# Altium project CANPLC_IO_v1.PrjPcb
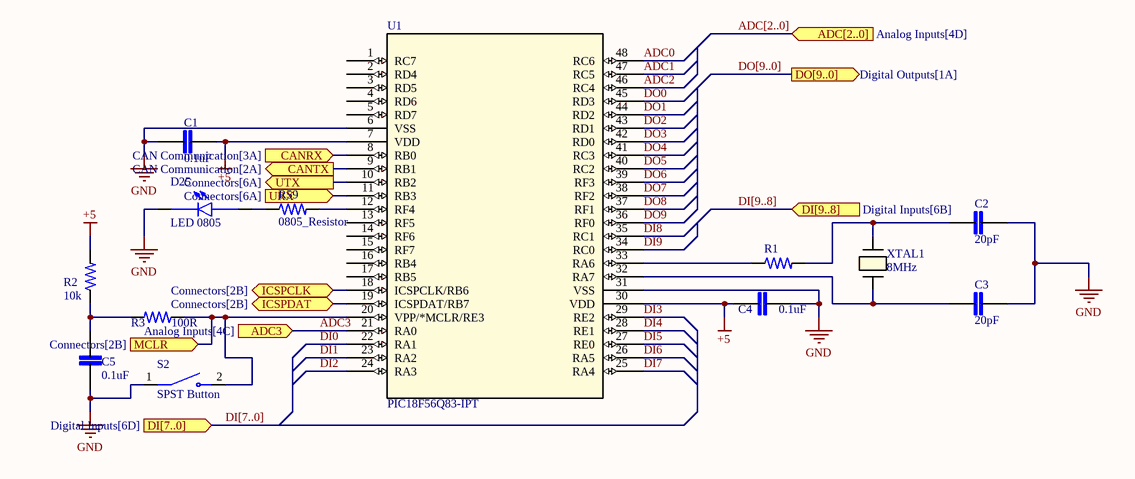
[diagram p0: PIC18F56Q83.SchDoc]
7 sheets, 136 parts. Net scope: flat (ports and power ports of the same name join across sheets).
Board files: TestPCB.PcbDoc, CANPLC_IO.PcbDoc
Sheets:
  PIC18F56Q83.SchDoc
  Digital Inputs.SchDoc
  Digital Outputs.SchDoc
  Analog Inputs.SchDoc
  CAN Communication.SchDoc
  Connectors.SchDoc
  Power.SchDoc

## Sheet PIC18F56Q83.SchDoc
size A4; SheetNumber: 1; SheetTotal: 7

### Parts
C1  0.1uF  [0805]
C2  20pF  [0805]
C3  20pF  [0805]
C4  0.1uF  [0805]
C5  0.1uF  [0805]
D25  LED 0805  [LED 0805]
R1  0805_Resistor  [0805]  (value not drawn)
R2  10k  [0805]
R3  100R  [0805]
R59  0805_Resistor  [0805]
S2  SPST Button  [SPST Button]
U1  PIC18F56Q83-IPT  [PIC18F56Q83-IPT]
XTAL1  8MHz  [Crystal 8MHz]

### Ports
ADC3 (in, see Analog Inputs[4C]), ADC[2..0] (in, see Analog Inputs[4D]), CANRX (in, see CAN Communication[3A]), CANTX (out, see CAN Communication[2A]), DI[7..0] (in, see Digital Inputs[6D]), DI[9..8] (in, see Digital Inputs[6B]), DO[9..0] (out, see Digital Outputs[1A]), ICSPCLK (bidir, see Connectors[2B]), ICSPDAT (bidir, see Connectors[2B]), MCLR (in, see Connectors[2B]), URX (in, see Connectors[6A]), UTX (out, see Connectors[6A])

### Nets
+5: C1.1 C4.1 R2.2 U1.7(VDD) U1.30(VDD)
GND: C1.2 C2.2 C3.2 C4.2 C5.1 D25.C S2.1 U1.6(VSS) U1.31(VSS)
ADC0: U1.48(RC6)
ADC1: U1.47(RC5)
ADC2: U1.46(RC4)
ADC3: U1.21(RA0) ; port ADC3
DI0: U1.22(RA1)
DI1: U1.23(RA2)
DI2: U1.24(RA3)
DI3: U1.29(RE2)
DI4: U1.28(RE1)
DI5: U1.27(RE0)
DI6: U1.26(RA5)
DI7: U1.25(RA4)
DI8: U1.35(RC1)
DI9: U1.34(RC0)
DO0: U1.45(RD3)
DO1: U1.44(RD2)
DO2: U1.43(RD1)
DO3: U1.42(RD0)
DO4: U1.41(RC3)
DO5: U1.40(RC2)
DO6: U1.39(RF3)
DO7: U1.38(RF2)
DO8: U1.37(RF1)
DO9: U1.36(RF0)
NetC2_1: C2.1 R1.2 XTAL1.2
NetC3_1: C3.1 U1.32(RA7) XTAL1.1
NetC5_2: C5.2 R2.1 R3.2
NetD25_A: D25.A R59.1
NetJ3_01: R3.1 S2.2 U1.20(VPP/*MCLR/RE3) ; port MCLR
NetJ3_04: U1.19(ICSPDAT/RB7) ; port ICSPDAT
NetJ3_05: U1.18(ICSPCLK/RB6) ; port ICSPCLK
NetJ4_3: U1.11(RB3) ; port URX
NetR1_1: R1.1 U1.33(RA6)
NetR57_1: U1.10(RB2) ; port UTX
NetR59_2: R59.2 U1.12(RF4)
NetU1_8: U1.8(RB0) ; port CANRX
NetU1_9: U1.9(RB1) ; port CANTX

Not connected (* = marked no-connect by the designer): U1 1(RC7) 2(RD4) 3(RD5) 4(RD6) 5(RD7) 13(RF5) 14(RF6) 15(RF7) 16(RB4) 17(RB5)

### Buses and harness runs
bus ADC[2..0] = port ADC[2..0]
bus DI[7..0] = port DI[7..0]
bus DI[9..8] = port DI[9..8]
bus DO[9..0] = port DO[9..0]

### Library data of the parts
C1-C5 = 0805_Capacitor: MP: LD051A121KAB2A; MF: AVX; SnapEDA_Link: https://www.snapeda.com/parts/LD051A121KAB2A/AVX/view-part/?ref=snap; Package: 0805 AVX; Check_prices: https://www.snapeda.com/parts/LD051A121KAB2A/AVX/view-part/?ref=eda; Purchase-URL: https://pricing.snapeda.com/search/part/LD051A121KAB2A/?ref=eda; Price: None; Value: *; Availability: In Stock
D25 = LED 0805: LED Uni-Color Green 4-Pin Chip 0805 T/R; MP: 597-3305-607F; Availability: Unavailable; Value: *; Price: None; Package: None
R1-R3 R59 = 0805_Resistor: Power_Rating: .25 W; MP: 2-2176053-0; Tolerance: 1%; Resistance: .33; MF: TE Connectivity; Price: None; Availability: In Stock; EU_RoHS_Compliance: Compliant with Exemptions; Package: 0805; Value: *; SnapEDA_Link: https://www.snapeda.com/parts/2-2176053-0/TE+Connectivity/view-part/?ref=snap; Check_prices: https://www.snapeda.com/parts/2-2176053-0/TE+Connectivity/view-part/?ref=eda
S2 = SPST Button: 3mmX6mm; MP: B3U-1000P; Price: None; Availability: Unavailable; Value: *; Package: None
U1 = PIC18F56Q83-IPT: No Description Available; Mfr_Name: Microchip; RefDes: RefDes; Type: Type
XTAL1 = Crystal 8MHz: 5032; Mfr_Name: Epson; Manufacturer_Part_Number: SC32A-12.5PF20PPM; Copyright: Copyright (C) 2024 Ultra Librarian. All rights reserved.; RefDes: RefDes; Type: DEV

## Sheet Digital Inputs.SchDoc
size A3; SheetNumber: 2; SheetTotal: 7
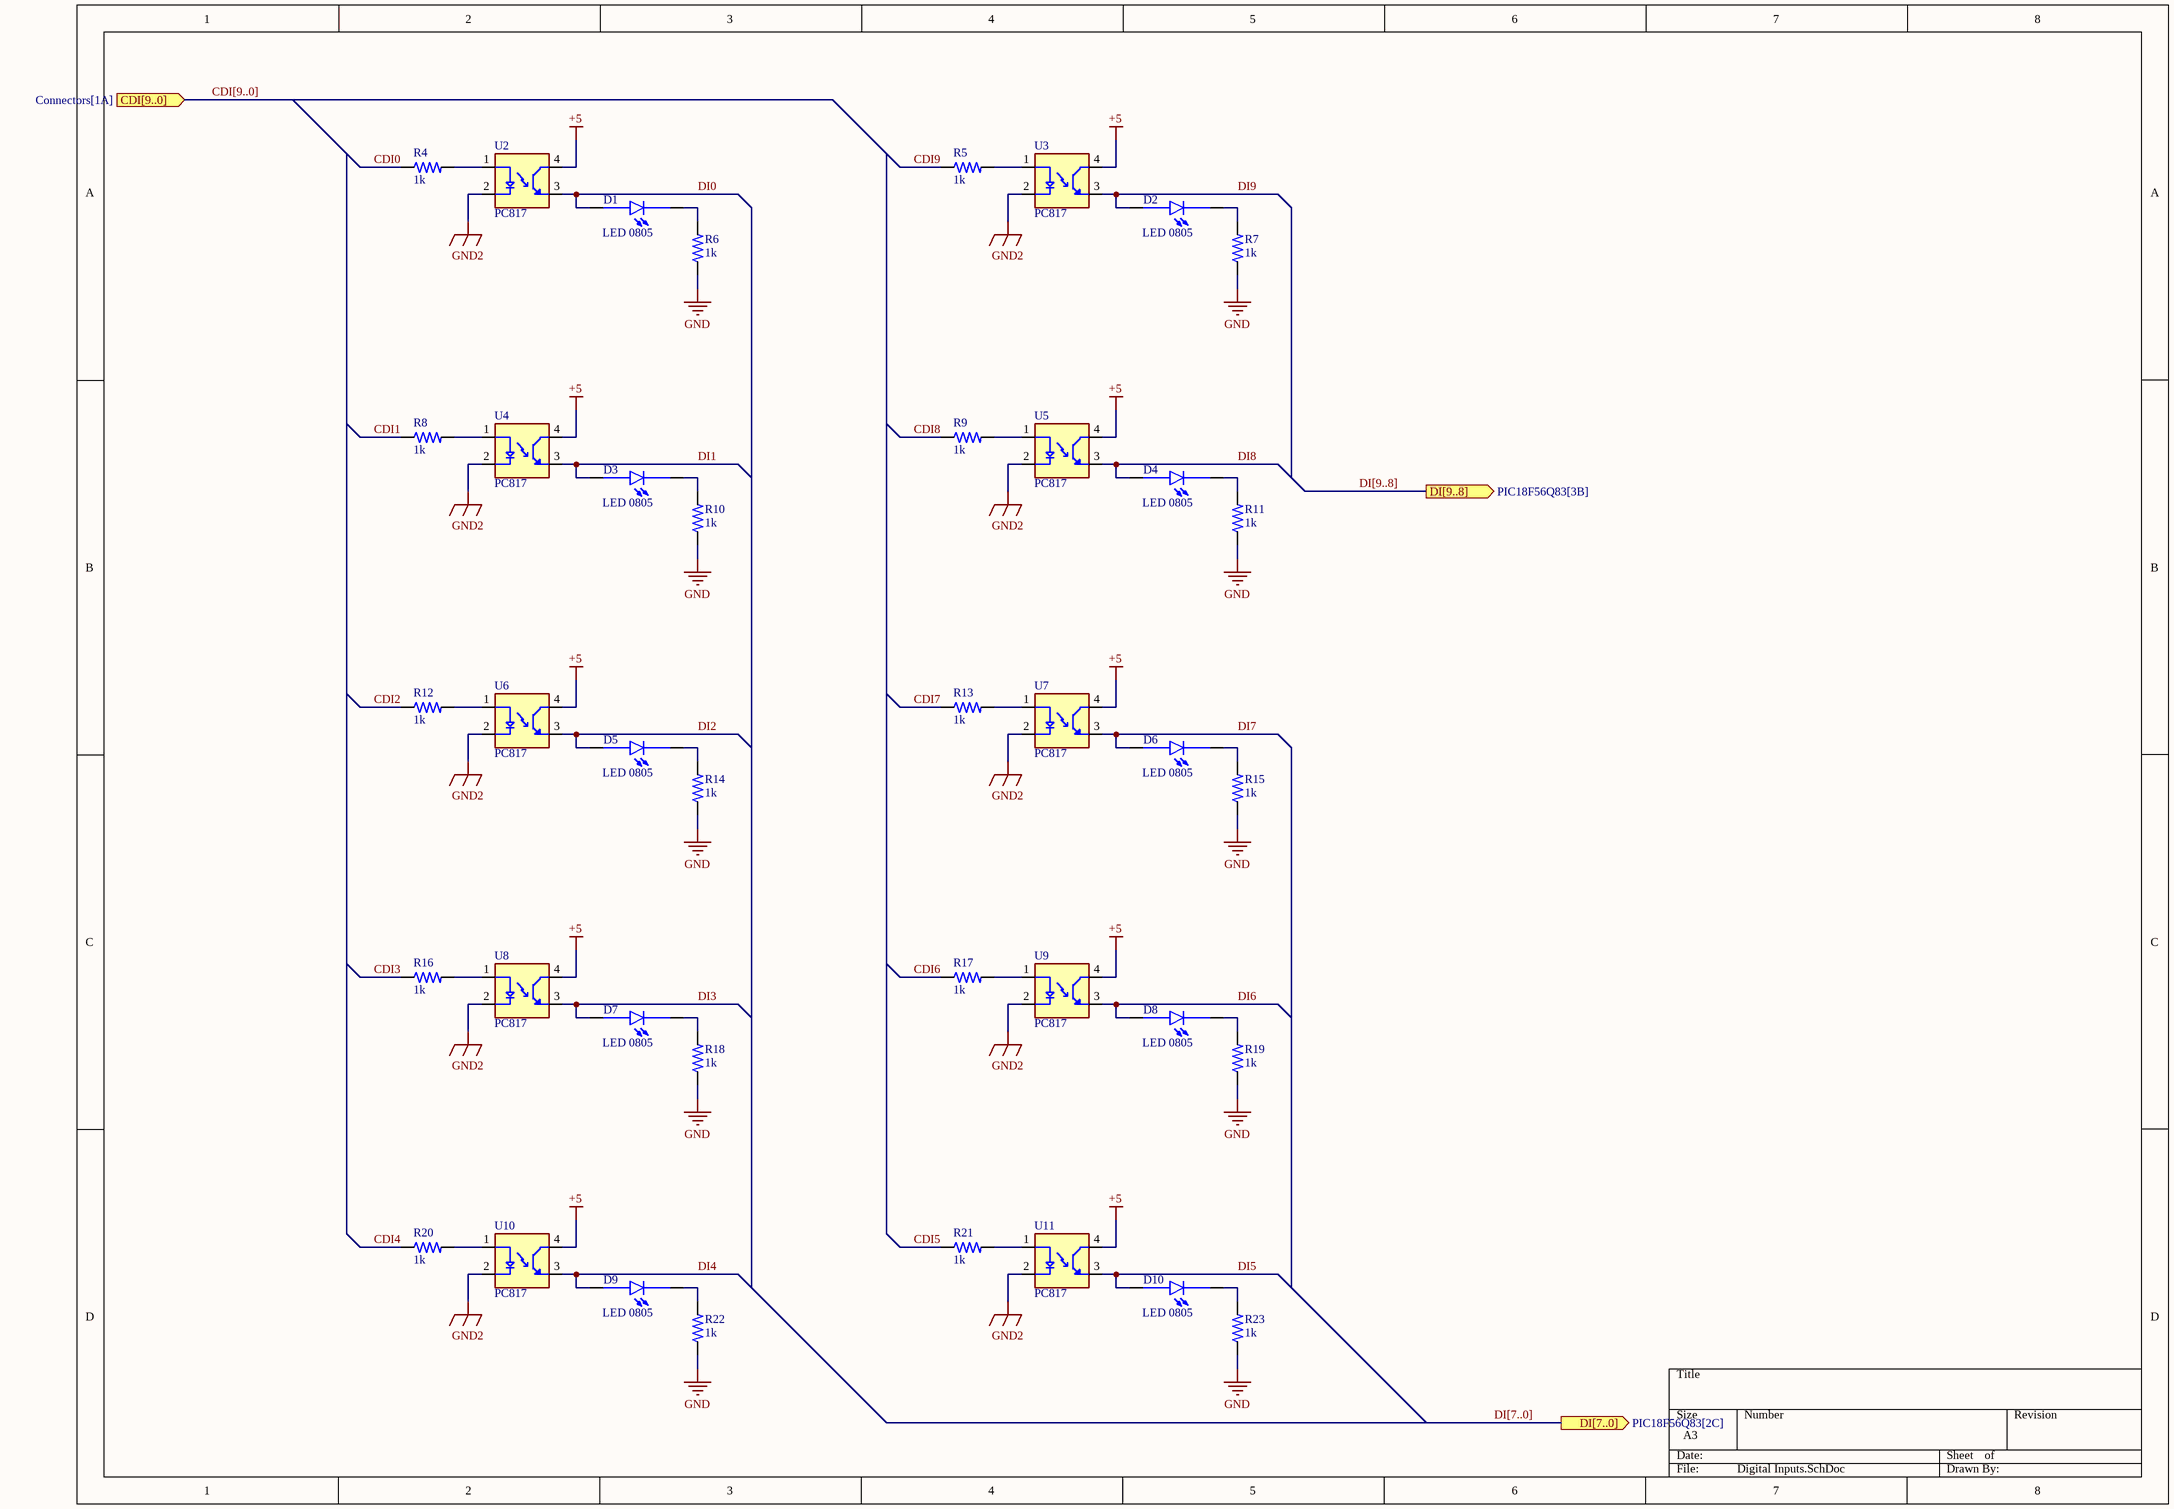
[diagram p1: Digital Inputs.SchDoc]

### Parts
D1  LED 0805  [LED 0805]
D2  LED 0805  [LED 0805]
D3  LED 0805  [LED 0805]
D4  LED 0805  [LED 0805]
D5  LED 0805  [LED 0805]
D6  LED 0805  [LED 0805]
D7  LED 0805  [LED 0805]
D8  LED 0805  [LED 0805]
D9  LED 0805  [LED 0805]
D10  LED 0805  [LED 0805]
R4  1k  [0805]
R5  1k  [0805]
R6  1k  [0805]
R7  1k  [0805]
R8  1k  [0805]
R9  1k  [0805]
R10  1k  [0805]
R11  1k  [0805]
R12  1k  [0805]
R13  1k  [0805]
R14  1k  [0805]
R15  1k  [0805]
R16  1k  [0805]
R17  1k  [0805]
R18  1k  [0805]
R19  1k  [0805]
R20  1k  [0805]
R21  1k  [0805]
R22  1k  [0805]
R23  1k  [0805]
U2  PC817  [PC817]
U3  PC817  [PC817]
U4  PC817  [PC817]
U5  PC817  [PC817]
U6  PC817  [PC817]
U7  PC817  [PC817]
U8  PC817  [PC817]
U9  PC817  [PC817]
U10  PC817  [PC817]
U11  PC817  [PC817]

### Ports
CDI[9..0] (in, see Connectors[1A]), DI[7..0] (out, see PIC18F56Q83[2C]), DI[9..8] (out, see PIC18F56Q83[3B])

### Nets
+5: U2.4(CT) U3.4(CT) U4.4(CT) U5.4(CT) U6.4(CT) U7.4(CT) U8.4(CT) U9.4(CT) U10.4(CT) U11.4(CT)
GND: R6.1 R7.1 R10.1 R11.1 R14.1 R15.1 R18.1 R19.1 R22.1 R23.1
GND2: U2.2(C) U3.2(C) U4.2(C) U5.2(C) U6.2(C) U7.2(C) U8.2(C) U9.2(C) U10.2(C) U11.2(C)
CDI0: R4.1
CDI1: R8.1
CDI2: R12.1
CDI3: R16.1
CDI4: R20.1
CDI5: R21.1
CDI6: R17.1
CDI7: R13.1
CDI8: R9.1
CDI9: R5.1
DI0: D1.A U2.3(ET)
DI1: D3.A U4.3(ET)
DI2: D5.A U6.3(ET)
DI3: D7.A U8.3(ET)
DI4: D9.A U10.3(ET)
DI5: D10.A U11.3(ET)
DI6: D8.A U9.3(ET)
DI7: D6.A U7.3(ET)
DI8: D4.A U5.3(ET)
DI9: D2.A U3.3(ET)
NetD1_C: D1.C R6.2
NetD2_C: D2.C R7.2
NetD3_C: D3.C R10.2
NetD4_C: D4.C R11.2
NetD5_C: D5.C R14.2
NetD6_C: D6.C R15.2
NetD7_C: D7.C R18.2
NetD8_C: D8.C R19.2
NetD9_C: D9.C R22.2
NetD10_C: D10.C R23.2
NetR4_2: R4.2 U2.1(A)
NetR5_2: R5.2 U3.1(A)
NetR8_2: R8.2 U4.1(A)
NetR9_2: R9.2 U5.1(A)
NetR12_2: R12.2 U6.1(A)
NetR13_2: R13.2 U7.1(A)
NetR16_2: R16.2 U8.1(A)
NetR17_2: R17.2 U9.1(A)
NetR20_2: R20.2 U10.1(A)
NetR21_2: R21.2 U11.1(A)

### Buses and harness runs
bus CDI[9..0] = port CDI[9..0]
bus DI[7..0] = port DI[7..0]
bus DI[9..8] = port DI[9..8]

### Library data of the parts
D1-D10 = LED 0805: as D25 on sheet PIC18F56Q83; Availability: Unavailable; Value: *; Price: None; Package: None
R4-R23 = 0805_Resistor: as R1 on sheet PIC18F56Q83; Price: None; Availability: In Stock; EU_RoHS_Compliance: Compliant with Exemptions; Package: 0805; Value: *; SnapEDA_Link: https://www.snapeda.com/parts/2-2176053-0/TE+Connectivity/view-part/?ref=snap; Check_prices: https://www.snapeda.com/parts/2-2176053-0/TE+Connectivity/view-part/?ref=eda
U2-U11 = PC817: Optoisolator Transistor Output 5000Vrms 1 Channel 4-SMD; MP: PC817XI; MF: Sharp Microelectronics; Price: None; Availability: In Stock; Package: SMD-4 Sharp Microelectronics; Value: *; SnapEDA_Link: https://www.snapeda.com/parts/PC817XI/Sharp+Microelectronics/view-part/?ref=snap; Purchase-URL: https://pricing.snapeda.com/search/part/PC817XI/?ref=eda; Check_prices: https://www.snapeda.com/parts/PC817XI/Sharp+Microelectronics/view-part/?ref=eda

## Sheet Digital Outputs.SchDoc
size A3; SheetNumber: 3; SheetTotal: 7
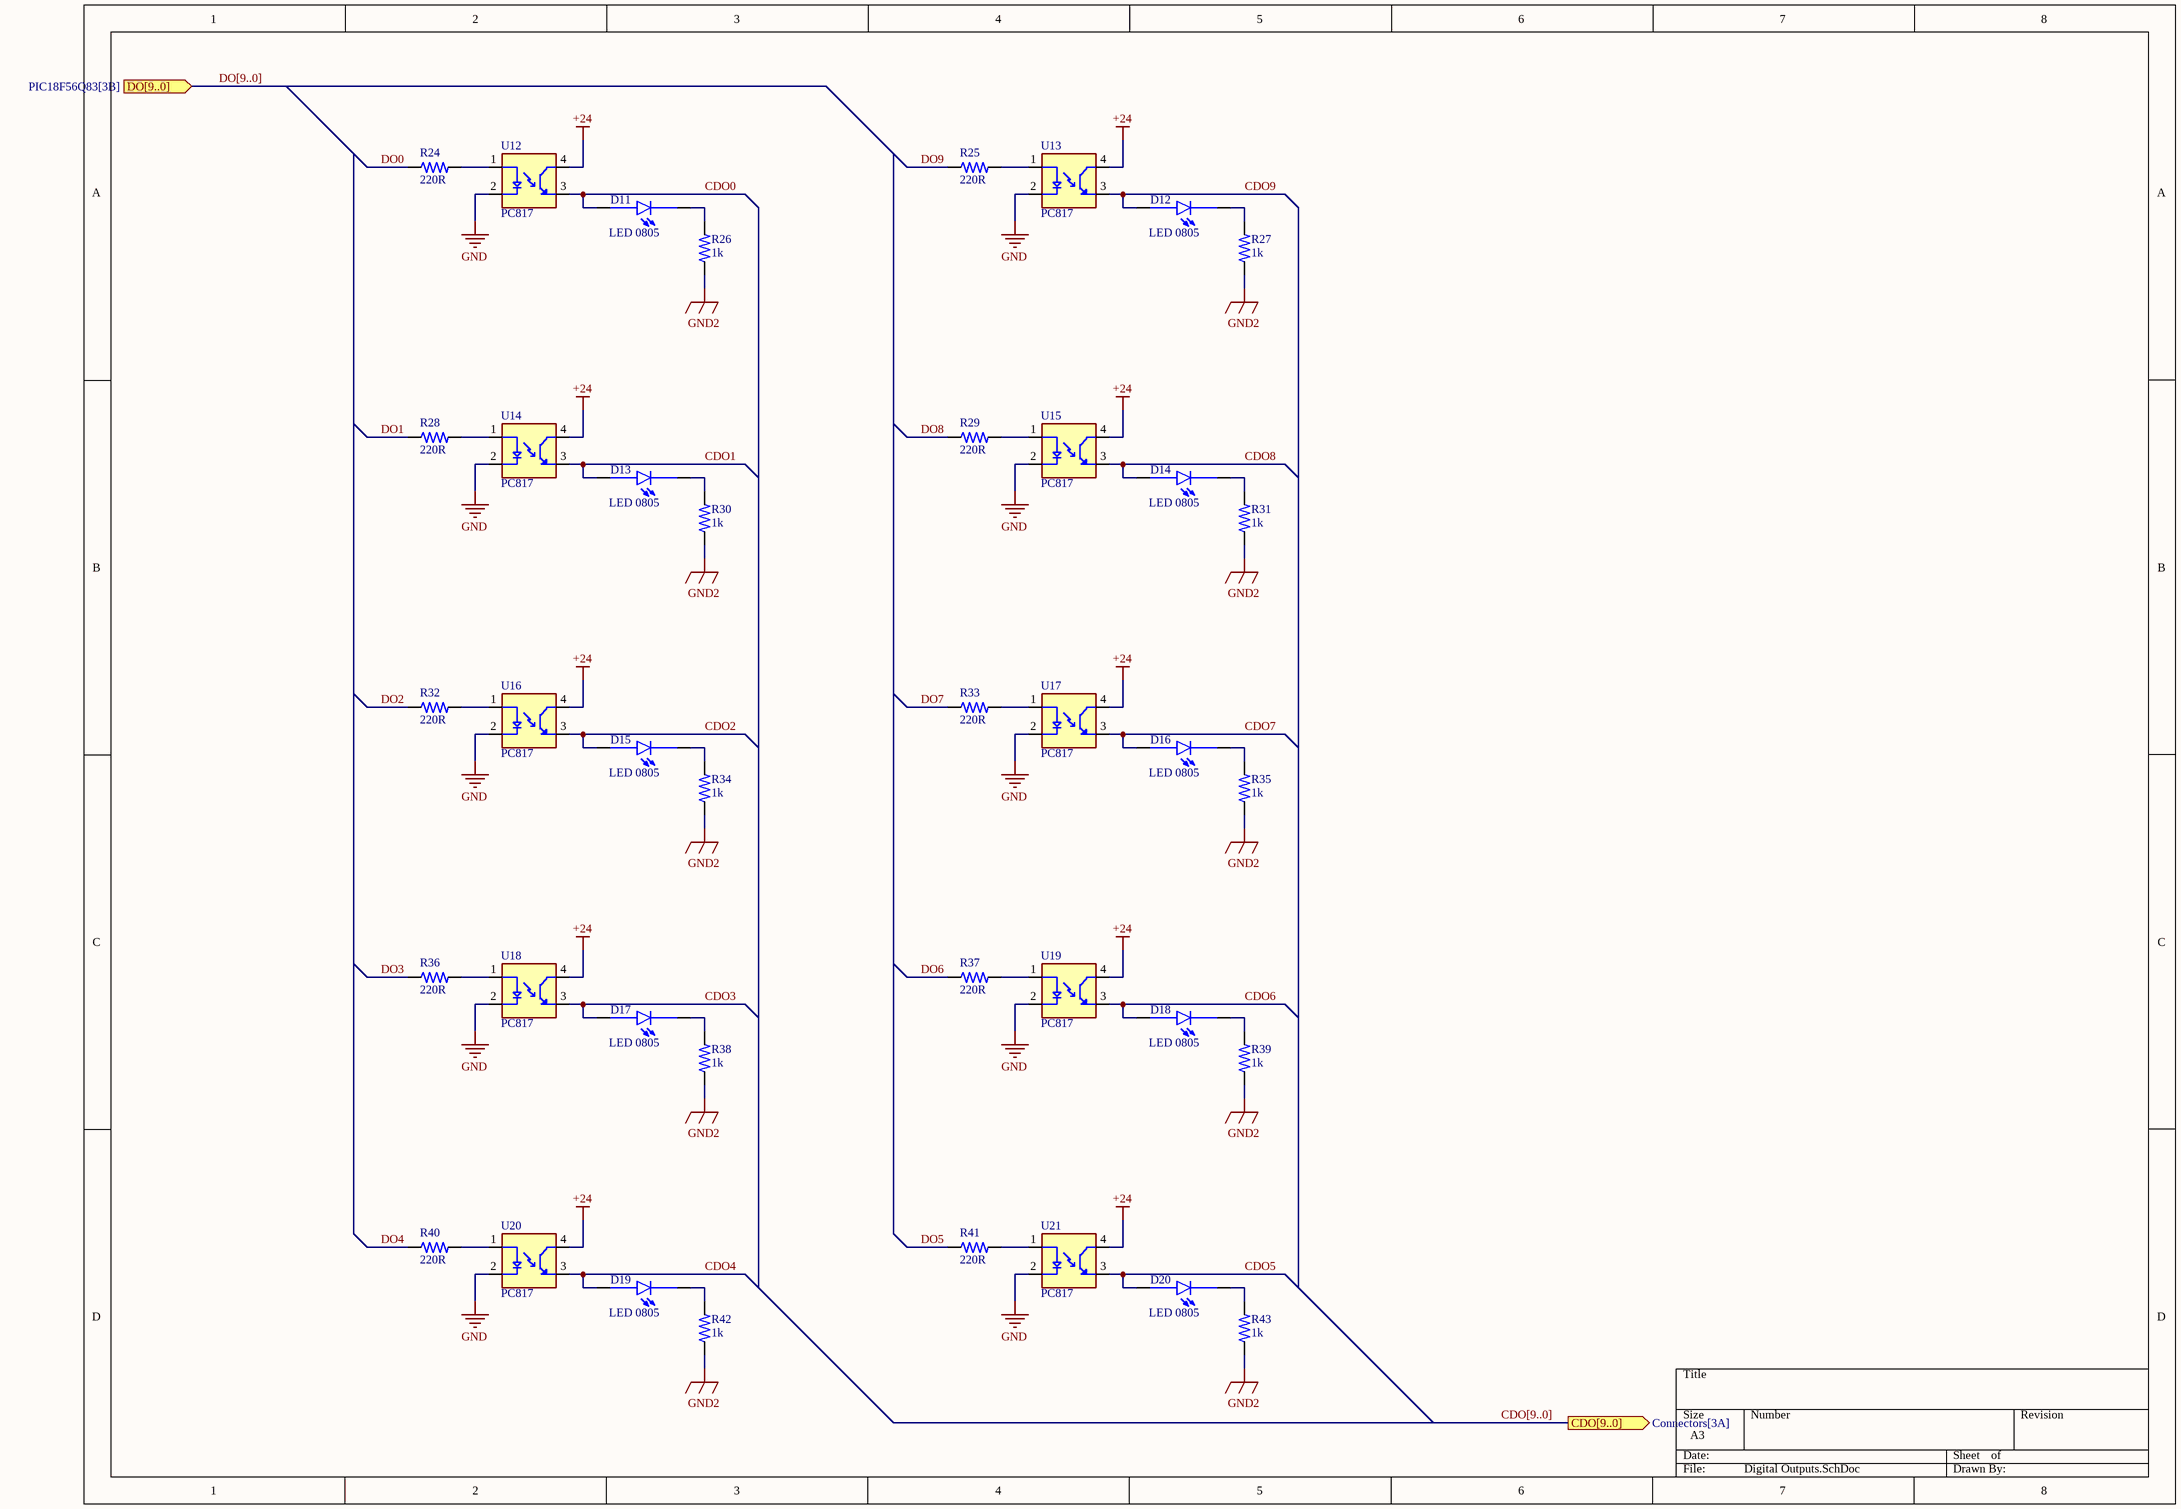
[diagram p2: Digital Outputs.SchDoc]

### Parts
D11  LED 0805  [LED 0805]
D12  LED 0805  [LED 0805]
D13  LED 0805  [LED 0805]
D14  LED 0805  [LED 0805]
D15  LED 0805  [LED 0805]
D16  LED 0805  [LED 0805]
D17  LED 0805  [LED 0805]
D18  LED 0805  [LED 0805]
D19  LED 0805  [LED 0805]
D20  LED 0805  [LED 0805]
R24  220R  [0805]
R25  220R  [0805]
R26  1k  [0805]
R27  1k  [0805]
R28  220R  [0805]
R29  220R  [0805]
R30  1k  [0805]
R31  1k  [0805]
R32  220R  [0805]
R33  220R  [0805]
R34  1k  [0805]
R35  1k  [0805]
R36  220R  [0805]
R37  220R  [0805]
R38  1k  [0805]
R39  1k  [0805]
R40  220R  [0805]
R41  220R  [0805]
R42  1k  [0805]
R43  1k  [0805]
U12  PC817  [PC817]
U13  PC817  [PC817]
U14  PC817  [PC817]
U15  PC817  [PC817]
U16  PC817  [PC817]
U17  PC817  [PC817]
U18  PC817  [PC817]
U19  PC817  [PC817]
U20  PC817  [PC817]
U21  PC817  [PC817]

### Ports
CDO[9..0] (out, see Connectors[3A]), DO[9..0] (in, see PIC18F56Q83[3B])

### Nets
+24: U12.4(CT) U13.4(CT) U14.4(CT) U15.4(CT) U16.4(CT) U17.4(CT) U18.4(CT) U19.4(CT) U20.4(CT) U21.4(CT)
GND: U12.2(C) U13.2(C) U14.2(C) U15.2(C) U16.2(C) U17.2(C) U18.2(C) U19.2(C) U20.2(C) U21.2(C)
GND2: R26.1 R27.1 R30.1 R31.1 R34.1 R35.1 R38.1 R39.1 R42.1 R43.1
CDO0: D11.A U12.3(ET)
CDO1: D13.A U14.3(ET)
CDO2: D15.A U16.3(ET)
CDO3: D17.A U18.3(ET)
CDO4: D19.A U20.3(ET)
CDO5: D20.A U21.3(ET)
CDO6: D18.A U19.3(ET)
CDO7: D16.A U17.3(ET)
CDO8: D14.A U15.3(ET)
CDO9: D12.A U13.3(ET)
DO0: R24.1
DO1: R28.1
DO2: R32.1
DO3: R36.1
DO4: R40.1
DO5: R41.1
DO6: R37.1
DO7: R33.1
DO8: R29.1
DO9: R25.1
NetD11_C: D11.C R26.2
NetD12_C: D12.C R27.2
NetD13_C: D13.C R30.2
NetD14_C: D14.C R31.2
NetD15_C: D15.C R34.2
NetD16_C: D16.C R35.2
NetD17_C: D17.C R38.2
NetD18_C: D18.C R39.2
NetD19_C: D19.C R42.2
NetD20_C: D20.C R43.2
NetR24_2: R24.2 U12.1(A)
NetR25_2: R25.2 U13.1(A)
NetR28_2: R28.2 U14.1(A)
NetR29_2: R29.2 U15.1(A)
NetR32_2: R32.2 U16.1(A)
NetR33_2: R33.2 U17.1(A)
NetR36_2: R36.2 U18.1(A)
NetR37_2: R37.2 U19.1(A)
NetR40_2: R40.2 U20.1(A)
NetR41_2: R41.2 U21.1(A)

### Buses and harness runs
bus CDO[9..0] = port CDO[9..0]
bus DO[9..0] = port DO[9..0]

### Library data of the parts
D11-D20 = LED 0805: as D25 on sheet PIC18F56Q83; Availability: Unavailable; Value: *; Price: None; Package: None
R24-R43 = 0805_Resistor: as R1 on sheet PIC18F56Q83; Price: None; Availability: In Stock; EU_RoHS_Compliance: Compliant with Exemptions; Package: 0805; Value: *; SnapEDA_Link: https://www.snapeda.com/parts/2-2176053-0/TE+Connectivity/view-part/?ref=snap; Check_prices: https://www.snapeda.com/parts/2-2176053-0/TE+Connectivity/view-part/?ref=eda
U12-U21 = PC817: as U2 on sheet Digital Inputs; Price: None; Availability: In Stock; Package: SMD-4 Sharp Microelectronics; Value: *; SnapEDA_Link: https://www.snapeda.com/parts/PC817XI/Sharp+Microelectronics/view-part/?ref=snap; Purchase-URL: https://pricing.snapeda.com/search/part/PC817XI/?ref=eda; Check_prices: https://www.snapeda.com/parts/PC817XI/Sharp+Microelectronics/view-part/?ref=eda

## Sheet Analog Inputs.SchDoc
size A4; SheetNumber: 4; SheetTotal: 7
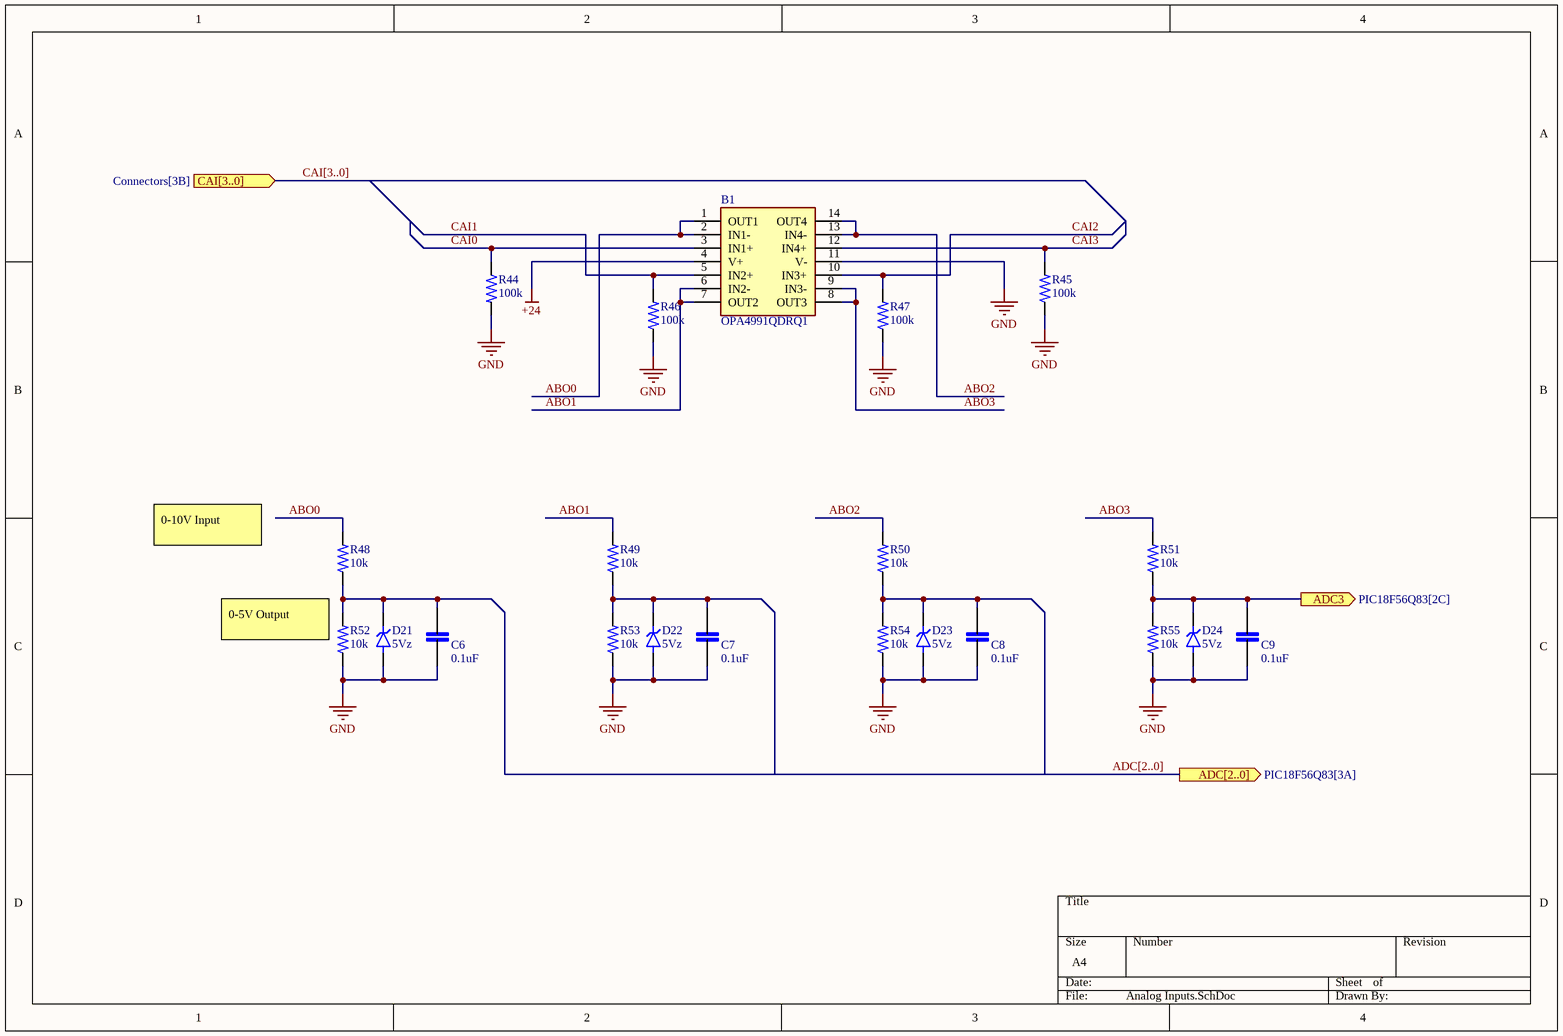
[diagram p3: Analog Inputs.SchDoc]

### Parts
B1  OPA4991QDRQ1  [OPA4991QDRQ1]
C6  0.1uF  [0805]
C7  0.1uF  [0805]
C8  0.1uF  [0805]
C9  0.1uF  [0805]
D21  5Vz  [SOD123]
D22  5Vz  [SOD123]
D23  5Vz  [SOD123]
D24  5Vz  [SOD123]
R44  100k  [0805]
R45  100k  [0805]
R46  100k  [0805]
R47  100k  [0805]
R48  10k  [0805]
R49  10k  [0805]
R50  10k  [0805]
R51  10k  [0805]
R52  10k  [0805]
R53  10k  [0805]
R54  10k  [0805]
R55  10k  [0805]

### Ports
ADC3 (out, see PIC18F56Q83[2C]), ADC[2..0] (out, see PIC18F56Q83[3A]), CAI[3..0] (in, see Connectors[3B])

### Nets
+24: B1.4(V+)
GND: B1.11(V-) C6.1 C7.1 C8.1 C9.1 D21.2(A) D22.2(A) D23.2(A) D24.2(A) R44.2 R45.1 R46.1 R47.1 R52.1 R53.1 R54.1 R55.1
ABO0: B1.1(OUT1) B1.2(IN1-) R48.2
ABO1: B1.6(IN2-) B1.7(OUT2) R49.2
ABO2: B1.13(IN4-) B1.14(OUT4) R50.2
ABO3: B1.8(OUT3) B1.9(IN3-) R51.2
ADC3: C9.2 D24.1(K) R51.1 R55.2 ; port ADC3
CAI0: B1.3(IN1+) R44.1
CAI1: B1.5(IN2+) R46.2
CAI2: B1.10(IN3+) R47.2
CAI3: B1.12(IN4+) R45.2
NetC6_2: C6.2 D21.1(K) R48.1 R52.2
NetC7_2: C7.2 D22.1(K) R49.1 R53.2
NetC8_2: C8.2 D23.1(K) R50.1 R54.2

### Buses and harness runs
bus ADC[2..0] = port ADC[2..0]
bus CAI[3..0] = port CAI[3..0]

### Notes on the sheet
- (near R46) Atenção aos Grounds - Não Isolado - Meter Fusível
- 0-10V Input
- (near R52) 0-5V Output

### Library data of the parts
B1 = OPA4991QDRQ1: Operational Amplifiers - Op Amps Automotive-grade, quad, 40-V, 4.5-MHz, low-power operational amplifier; Manufacturer_Name: Texas Instruments; Geometry.Height: 1.75mm; Mouser Part Number: 595-OPA4991QDRQ1; Mouser Price/Stock: https://www.mouser.co.uk/ProductDetail/Texas-Instruments/OPA4991QDRQ1?qs=Rp5uXu7WBW8O3FoPRuKIAQ%3D%3D; Manufacturer_Part_Number: OPA4991QDRQ1; Datasheet Link: https://www.ti.com/lit/ds/symlink/opa4991-q1.pdf?ts=1681108583924&ref_url=https%253A%252F%252Fwww.ti.com%252Fsitesearch%252Fen-us%252Fdocs%252Funiversalsearch.tsp%253FlangPref%253Den-US%2526searchTerm%253DOPA4991QDRQ1%2526nr%253D8
C6-C9 = 0805_Capacitor: MP: LD051A121KAB2A; MF: AVX; SnapEDA_Link: https://www.snapeda.com/parts/LD051A121KAB2A/AVX/view-part/?ref=snap; Package: 0805 AVX; Check_prices: https://www.snapeda.com/parts/LD051A121KAB2A/AVX/view-part/?ref=eda; Purchase-URL: https://pricing.snapeda.com/search/part/LD051A121KAB2A/?ref=eda; Price: None; Value: *; Availability: In Stock
D21-D24 = SOD123 - Zener Diode: MP: 1SMA5926; MF: Taiwan Semiconductor; Package: SMA-2 Taiwan Semiconductor; Availability: In Stock; Purchase-URL: https://pricing.snapeda.com/search/part/1SMA5926/?ref=eda; SnapEDA_Link: https://www.snapeda.com/parts/1SMA5926/Taiwan+Semiconductor/view-part/?ref=snap; Price: None; Check_prices: https://www.snapeda.com/parts/1SMA5926/Taiwan+Semiconductor/view-part/?ref=eda; Value: *
R44-R55 = 0805_Resistor: as R1 on sheet PIC18F56Q83; Price: None; Availability: In Stock; EU_RoHS_Compliance: Compliant with Exemptions; Package: 0805; Value: *; SnapEDA_Link: https://www.snapeda.com/parts/2-2176053-0/TE+Connectivity/view-part/?ref=snap; Check_prices: https://www.snapeda.com/parts/2-2176053-0/TE+Connectivity/view-part/?ref=eda

## Sheet CAN Communication.SchDoc
size A4; SheetNumber: 5; SheetTotal: 7
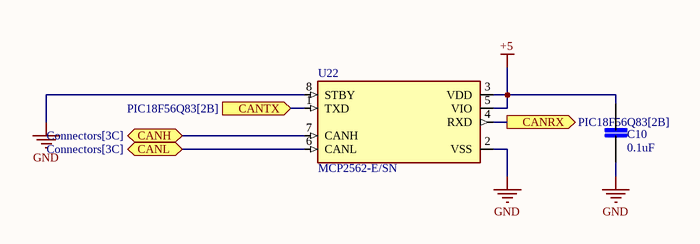
[diagram p4: CAN Communication.SchDoc]

### Parts
C10  0.1uF  [0805]
U22  MCP2562-E/SN  [MCP2562-E/SN]

### Ports
CANH (bidir, see Connectors[3C]), CANL (bidir, see Connectors[3C]), CANRX (out, see PIC18F56Q83[2B]), CANTX (in, see PIC18F56Q83[2B])

### Nets
+5: C10.2 U22.3(VDD) U22.5(VIO)
GND: C10.1 U22.2(VSS) U22.8(STBY)
CAN_N: U22.6(CANL) ; port CANL
CAN_P: U22.7(CANH) ; port CANH
NetU1_8: U22.4(RXD) ; port CANRX
NetU1_9: U22.1(TXD) ; port CANTX

### Library data of the parts
C10 = 0805_Capacitor: MP: LD051A121KAB2A; MF: AVX; SnapEDA_Link: https://www.snapeda.com/parts/LD051A121KAB2A/AVX/view-part/?ref=snap; Package: 0805 AVX; Check_prices: https://www.snapeda.com/parts/LD051A121KAB2A/AVX/view-part/?ref=eda; Purchase-URL: https://pricing.snapeda.com/search/part/LD051A121KAB2A/?ref=eda; Price: None; Value: *; Availability: In Stock
U22 = MCP2562-E/SN: 1/1 Transceiver Half CANbus 8-SOIC; MF: Microchip; Value: *; Availability: Unavailable; Package: SO-8 Microchip; Price: None; SnapEDA_Link: https://www.snapeda.com/parts/MCP2562-E/SN/Microchip/view-part/1055306/?ref=snap; MP: MCP2562-E/SN

## Sheet Connectors.SchDoc
size A3; SheetNumber: 6; SheetTotal: 7
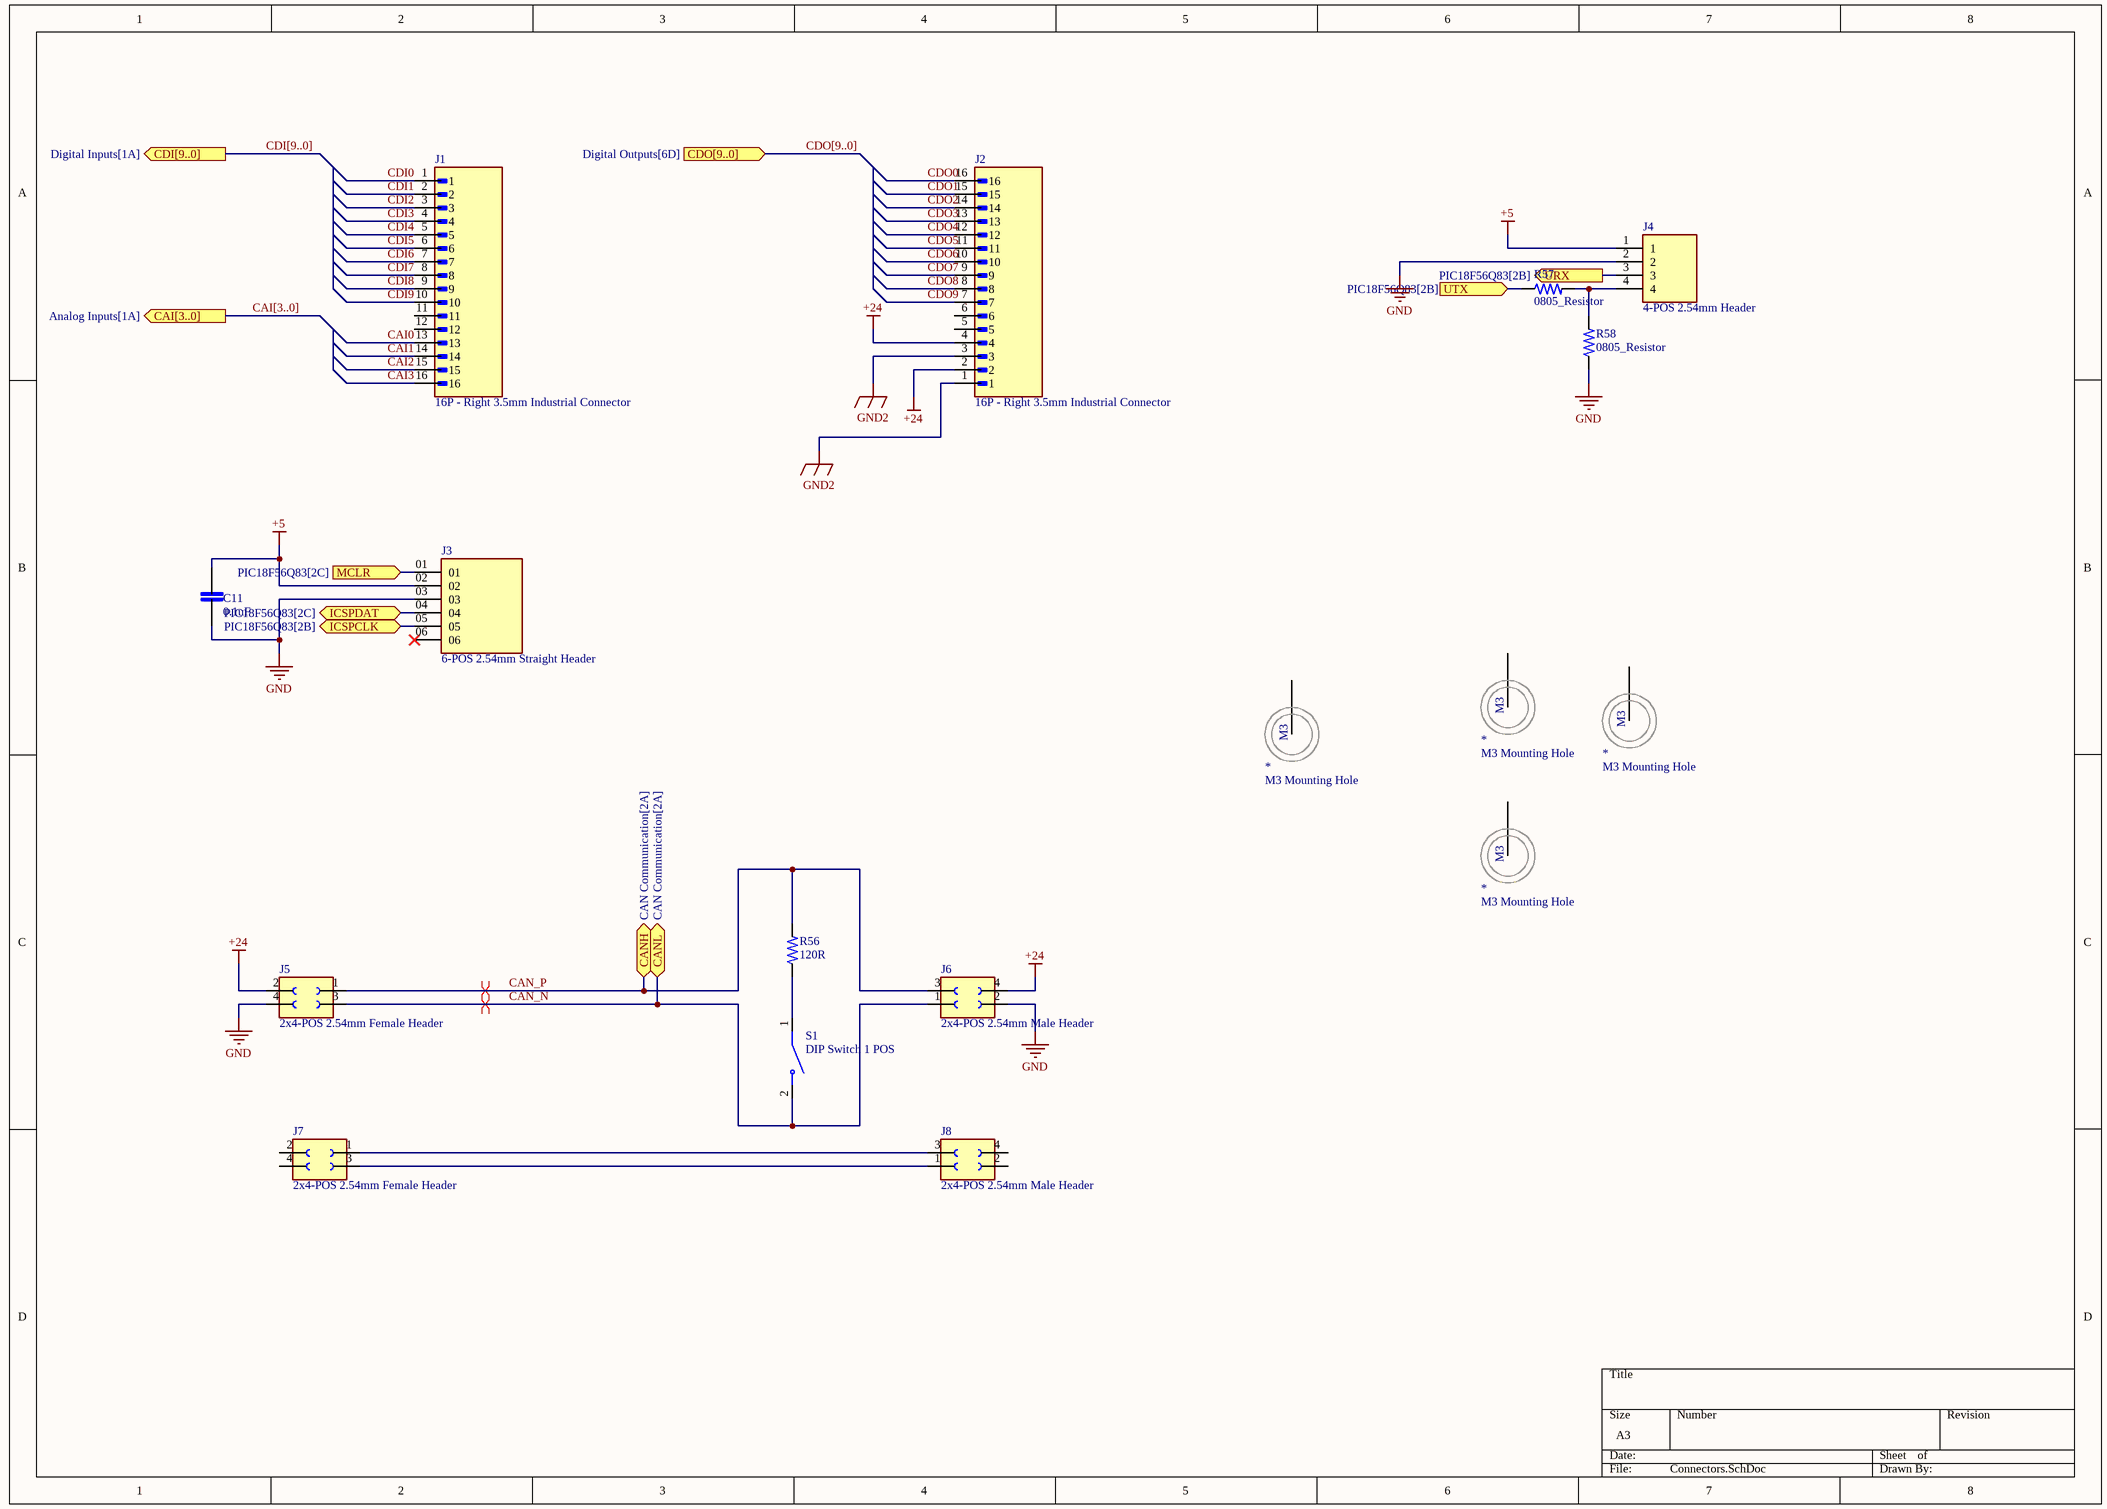
[diagram p5: Connectors.SchDoc]

### Parts
(Parts that share a designator on the sheet are numbered #1, #2 ... from top to bottom, then left to right.)
*#1  M3 Mounting Hole  [M3 - Mounting Hole]
*#2  M3 Mounting Hole  [M3 - Mounting Hole]
*#3  M3 Mounting Hole  [M3 - Mounting Hole]
*#4  M3 Mounting Hole  [M3 - Mounting Hole]
C11  0.1uF  [0805]
J1  16P - Right 3.5mm Industrial Connector  [16P - Right 3.5mm Industrial Connector]
J2  16P - Right 3.5mm Industrial Connector  [16P - Right 3.5mm Industrial Connector]
J3  6-POS 2.54mm Straight Header  [6-POS 2.54mm Header]
J4  4-POS 2.54mm Header  [4-POS 2.54mm Header]
J5  2x4-POS 2.54mm Female Header  [2x4-POS 2.54mm Female Header]
J6  2x4-POS 2.54mm Male Header  [2x4-POS 2.54mm Male Header]
J7  2x4-POS 2.54mm Female Header  [2x4-POS 2.54mm Female Header]
J8  2x4-POS 2.54mm Male Header  [2x4-POS 2.54mm Male Header]
R56  120R  [0805]
R57  0805_Resistor  [0805]
R58  0805_Resistor  [0805]
S1  DIP Switch 1 POS  [DIP Switch 1 POS]

### Ports
CAI[3..0] (out, see Analog Inputs[1A]), CANH (bidir, see CAN Communication[2A]), CANL (bidir, see CAN Communication[2A]), CDI[9..0] (out, see Digital Inputs[1A]), CDO[9..0] (in, see Digital Outputs[6D]), ICSPCLK (bidir, see PIC18F56Q83[2B]), ICSPDAT (bidir, see PIC18F56Q83[2C]), MCLR (in, see PIC18F56Q83[2C]), URX (out, see PIC18F56Q83[2B]), UTX (in, see PIC18F56Q83[2B])

### Nets
+5: C11.1 J3.02 J4.1
+24: J2.2 J2.4 J5.2 J6.4
GND: C11.2 J3.03 J4.2 J5.4 J6.2 R58.1
GND2: J2.1 J2.3
CAI0: J1.13
CAI1: J1.14
CAI2: J1.15
CAI3: J1.16
CAN_N: J5.3 J6.1 S1.2 ; port CANL
CAN_P: J5.1 J6.3 R56.2 ; port CANH
CDI0: J1.1
CDI1: J1.2
CDI2: J1.3
CDI3: J1.4
CDI4: J1.5
CDI5: J1.6
CDI6: J1.7
CDI7: J1.8
CDI8: J1.9
CDI9: J1.10
CDO0: J2.16
CDO1: J2.15
CDO2: J2.14
CDO3: J2.13
CDO4: J2.12
CDO5: J2.11
CDO6: J2.10
CDO7: J2.9
CDO8: J2.8
CDO9: J2.7
NetJ3_01: J3.01 ; port MCLR
NetJ3_04: J3.04 ; port ICSPDAT
NetJ3_05: J3.05 ; port ICSPCLK
NetJ4_3: J4.3 ; port URX
NetJ4_4: J4.4 R57.2 R58.2
NetJ7_1: J7.1 J8.3
NetJ7_3: J7.3 J8.1
NetR56_1: R56.1 S1.1
NetR57_1: R57.1 ; port UTX

Not connected (* = marked no-connect by the designer): *#1 1(M3); *#2 1(M3); *#3 1(M3); *#4 1(M3); J1 11 12; J2 5 6; J3 06*; J7 2(4) 4(3); J8 2(4) 4(3)

### Buses and harness runs
bus CAI[3..0] = port CAI[3..0]
bus CDI[9..0] = port CDI[9..0]
bus CDO[9..0] = port CDO[9..0]

### Layout directives
differential pair: CAN_N, CAN_P

### Library data of the parts
C11 = 0805_Capacitor: MP: LD051A121KAB2A; MF: AVX; SnapEDA_Link: https://www.snapeda.com/parts/LD051A121KAB2A/AVX/view-part/?ref=snap; Package: 0805 AVX; Check_prices: https://www.snapeda.com/parts/LD051A121KAB2A/AVX/view-part/?ref=eda; Purchase-URL: https://pricing.snapeda.com/search/part/LD051A121KAB2A/?ref=eda; Price: None; Value: *; Availability: In Stock
J1 J2 = 16P - Right 3.5mm Industrial Connector: MF: {'manufacturer': u'Phoenix Contact'}; MP: 1731811; Package: None; Price: None; Value: *; Availability: Unavailable
J3 = 6-POS 2.54mm Straight Header: HEADER, 6 CONTACTS, 1 ROW, THROUGH HOLE, 2.54 MM; Connector Systems:Board-to-Board; Pitch Spacing:2.54mm; No. of Rows:1Rows; No. of Contacts:6Contacts; Contact Termination Type:Through Hole Right Angle; Product Range:HTSW Series RoHS Compliant: Yes; MP: HTSW10608SSLA; MF: Samtec; Purchase-URL: https://pricing.snapeda.com/search/part/HTSW10608SSLA/?ref=eda; Package: None; Check_prices: https://www.snapeda.com/parts/HTSW10608SSLA/Samtec/view-part/?ref=eda; Price: None; SnapEDA_Link: https://www.snapeda.com/parts/HTSW10608SSLA/Samtec/view-part/?ref=snap; Availability: In Stock; Value: *
J4 = 4-POS 2.54mm Header: MP: 5-146290-4; Package: None; Price: None; Value: *; Availability: Unavailable
J5 J7 = 2x4-POS 2.54mm Female Header: MF: WÃ¼rth Elektronik; MP: 613004243121; SnapEDA_Link: https://www.snapeda.com/parts/613004243121/W%C3%BCrth%20Elektronik/view-part/1737074/?ref=snap; Check_prices: https://www.snapeda.com/parts/613004243121/W%C3%BCrth%20Elektronik/view-part/1737074/?ref=eda; Availability: Unavailable; Value: *; Price: None; Package: None
J6 J8 = 2x4-POS 2.54mm Male Header: MF: WÃ¼rth Elektronik; MP: 613004243121; SnapEDA_Link: https://www.snapeda.com/parts/613004243121/W%C3%BCrth%20Elektronik/view-part/1737074/?ref=snap; Check_prices: https://www.snapeda.com/parts/613004243121/W%C3%BCrth%20Elektronik/view-part/1737074/?ref=eda; Availability: Unavailable; Value: *; Price: None; Package: None
R56-R58 = 0805_Resistor: as R1 on sheet PIC18F56Q83; Price: None; Availability: In Stock; EU_RoHS_Compliance: Compliant with Exemptions; Package: 0805; Value: *; SnapEDA_Link: https://www.snapeda.com/parts/2-2176053-0/TE+Connectivity/view-part/?ref=snap; Check_prices: https://www.snapeda.com/parts/2-2176053-0/TE+Connectivity/view-part/?ref=eda
S1 = DIP Switch 1 POS: MP: KAE01SGGT; MF: E-Switch; Check_prices: https://www.snapeda.com/parts/KAE01SGGT/E-Switch/view-part/?ref=eda; Value: *; Availability: In Stock; Price: None; Package: None; SnapEDA_Link: https://www.snapeda.com/parts/KAE01SGGT/E-Switch/view-part/?ref=snap; Purchase-URL: https://pricing.snapeda.com/search/part/KAE01SGGT/?ref=eda

## Sheet Power.SchDoc
size A4; SheetNumber: 7; SheetTotal: 7
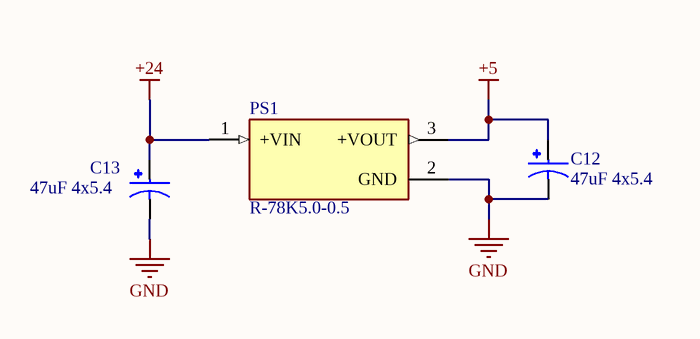
[diagram p6: Power.SchDoc]

### Parts
C12  47uF 4x5.4  [Electrolytic 4x5.4]
C13  47uF 4x5.4  [Electrolytic 4x5.4]
PS1  R-78K5.0-0.5  [CONV_R-78K5.0-0.5]

### Nets
+5: C12.1 PS1.3(+VOUT)
+24: C13.1 PS1.1(+VIN)
GND: C12.2 C13.2 PS1.2(GND)

### Library data of the parts
C12 C13 = Electrolytic 4x5.4: MF: Panasonic; MP: EEE-HA1E100WR; Package: RADIAL-2 Panasonic; Check_prices: https://www.snapeda.com/parts/EEE-HA1E100WR/Panasonic/view-part/778519/?ref=eda; Value: *; Price: None; Purchase-URL: https://pricing.snapeda.com/search/part/EEE-HA1E100WR/?ref=eda; SnapEDA_Link: https://www.snapeda.com/parts/EEE-HA1E100WR/Panasonic/view-part/778519/?ref=snap; Availability: In Stock
PS1 = R-78K5.0-0.5: 0.5A DC/DC-Converter 'INNOLINE' SIP3 reg; MF: Recom Power; Package: None; Value: *; Check_prices: https://www.snapeda.com/parts/R-78K5.0-0.5/Recom+Power/view-part/?ref=eda; Purchase-URL: https://pricing.snapeda.com/search/part/R-78K5.0-0.5/?ref=eda; Availability: In Stock; SnapEDA_Link: https://www.snapeda.com/parts/R-78K5.0-0.5/Recom+Power/view-part/?ref=snap; Price: None; MP: R-78K5.0-0.5

## Nets that join several sheets
+5: PIC18F56Q83 (5 pins), Digital Inputs (10 pins), CAN Communication (C10.2 U22.3 U22.5), Connectors (C11.1 J3.02 J4.1), Power (C12.1 PS1.3)
+24: Digital Outputs (10 pins), Analog Inputs (B1.4), Connectors (J2.2 J2.4 J5.2 J6.4), Power (C13.1 PS1.1)
GND: PIC18F56Q83 (9 pins), Digital Inputs (10 pins), Digital Outputs (10 pins), Analog Inputs (17 pins), CAN Communication (C10.1 U22.2 U22.8), Connectors (6 pins), Power (C12.2 C13.2 PS1.2)
GND2: Digital Inputs (10 pins), Digital Outputs (10 pins), Connectors (J2.1 J2.3)
ADC3: PIC18F56Q83 (U1.21), Analog Inputs (C9.2 D24.1 R51.1 R55.2)
CAI0: Analog Inputs (B1.3 R44.1), Connectors (J1.13)
CAI1: Analog Inputs (B1.5 R46.2), Connectors (J1.14)
CAI2: Analog Inputs (B1.10 R47.2), Connectors (J1.15)
CAI3: Analog Inputs (B1.12 R45.2), Connectors (J1.16)
CAN_N: CAN Communication (U22.6), Connectors (J5.3 J6.1 S1.2)
CAN_P: CAN Communication (U22.7), Connectors (J5.1 J6.3 R56.2)
CDI0: Digital Inputs (R4.1), Connectors (J1.1)
CDI1: Digital Inputs (R8.1), Connectors (J1.2)
CDI2: Digital Inputs (R12.1), Connectors (J1.3)
CDI3: Digital Inputs (R16.1), Connectors (J1.4)
CDI4: Digital Inputs (R20.1), Connectors (J1.5)
CDI5: Digital Inputs (R21.1), Connectors (J1.6)
CDI6: Digital Inputs (R17.1), Connectors (J1.7)
CDI7: Digital Inputs (R13.1), Connectors (J1.8)
CDI8: Digital Inputs (R9.1), Connectors (J1.9)
CDI9: Digital Inputs (R5.1), Connectors (J1.10)
CDO0: Digital Outputs (D11.A U12.3), Connectors (J2.16)
CDO1: Digital Outputs (D13.A U14.3), Connectors (J2.15)
CDO2: Digital Outputs (D15.A U16.3), Connectors (J2.14)
CDO3: Digital Outputs (D17.A U18.3), Connectors (J2.13)
CDO4: Digital Outputs (D19.A U20.3), Connectors (J2.12)
CDO5: Digital Outputs (D20.A U21.3), Connectors (J2.11)
CDO6: Digital Outputs (D18.A U19.3), Connectors (J2.10)
CDO7: Digital Outputs (D16.A U17.3), Connectors (J2.9)
CDO8: Digital Outputs (D14.A U15.3), Connectors (J2.8)
CDO9: Digital Outputs (D12.A U13.3), Connectors (J2.7)
DI0: PIC18F56Q83 (U1.22), Digital Inputs (D1.A U2.3)
DI1: PIC18F56Q83 (U1.23), Digital Inputs (D3.A U4.3)
DI2: PIC18F56Q83 (U1.24), Digital Inputs (D5.A U6.3)
DI3: PIC18F56Q83 (U1.29), Digital Inputs (D7.A U8.3)
DI4: PIC18F56Q83 (U1.28), Digital Inputs (D9.A U10.3)
DI5: PIC18F56Q83 (U1.27), Digital Inputs (D10.A U11.3)
DI6: PIC18F56Q83 (U1.26), Digital Inputs (D8.A U9.3)
DI7: PIC18F56Q83 (U1.25), Digital Inputs (D6.A U7.3)
DI8: PIC18F56Q83 (U1.35), Digital Inputs (D4.A U5.3)
DI9: PIC18F56Q83 (U1.34), Digital Inputs (D2.A U3.3)
DO0: PIC18F56Q83 (U1.45), Digital Outputs (R24.1)
DO1: PIC18F56Q83 (U1.44), Digital Outputs (R28.1)
DO2: PIC18F56Q83 (U1.43), Digital Outputs (R32.1)
DO3: PIC18F56Q83 (U1.42), Digital Outputs (R36.1)
DO4: PIC18F56Q83 (U1.41), Digital Outputs (R40.1)
DO5: PIC18F56Q83 (U1.40), Digital Outputs (R41.1)
DO6: PIC18F56Q83 (U1.39), Digital Outputs (R37.1)
DO7: PIC18F56Q83 (U1.38), Digital Outputs (R33.1)
DO8: PIC18F56Q83 (U1.37), Digital Outputs (R29.1)
DO9: PIC18F56Q83 (U1.36), Digital Outputs (R25.1)
NetJ3_01: PIC18F56Q83 (R3.1 S2.2 U1.20), Connectors (J3.01)
NetJ3_04: PIC18F56Q83 (U1.19), Connectors (J3.04)
NetJ3_05: PIC18F56Q83 (U1.18), Connectors (J3.05)
NetJ4_3: PIC18F56Q83 (U1.11), Connectors (J4.3)
NetR57_1: PIC18F56Q83 (U1.10), Connectors (R57.1)
NetU1_8: PIC18F56Q83 (U1.8), CAN Communication (U22.4)
NetU1_9: PIC18F56Q83 (U1.9), CAN Communication (U22.1)